# Altium schematic sheet Sheet1.SchDoc
size A3
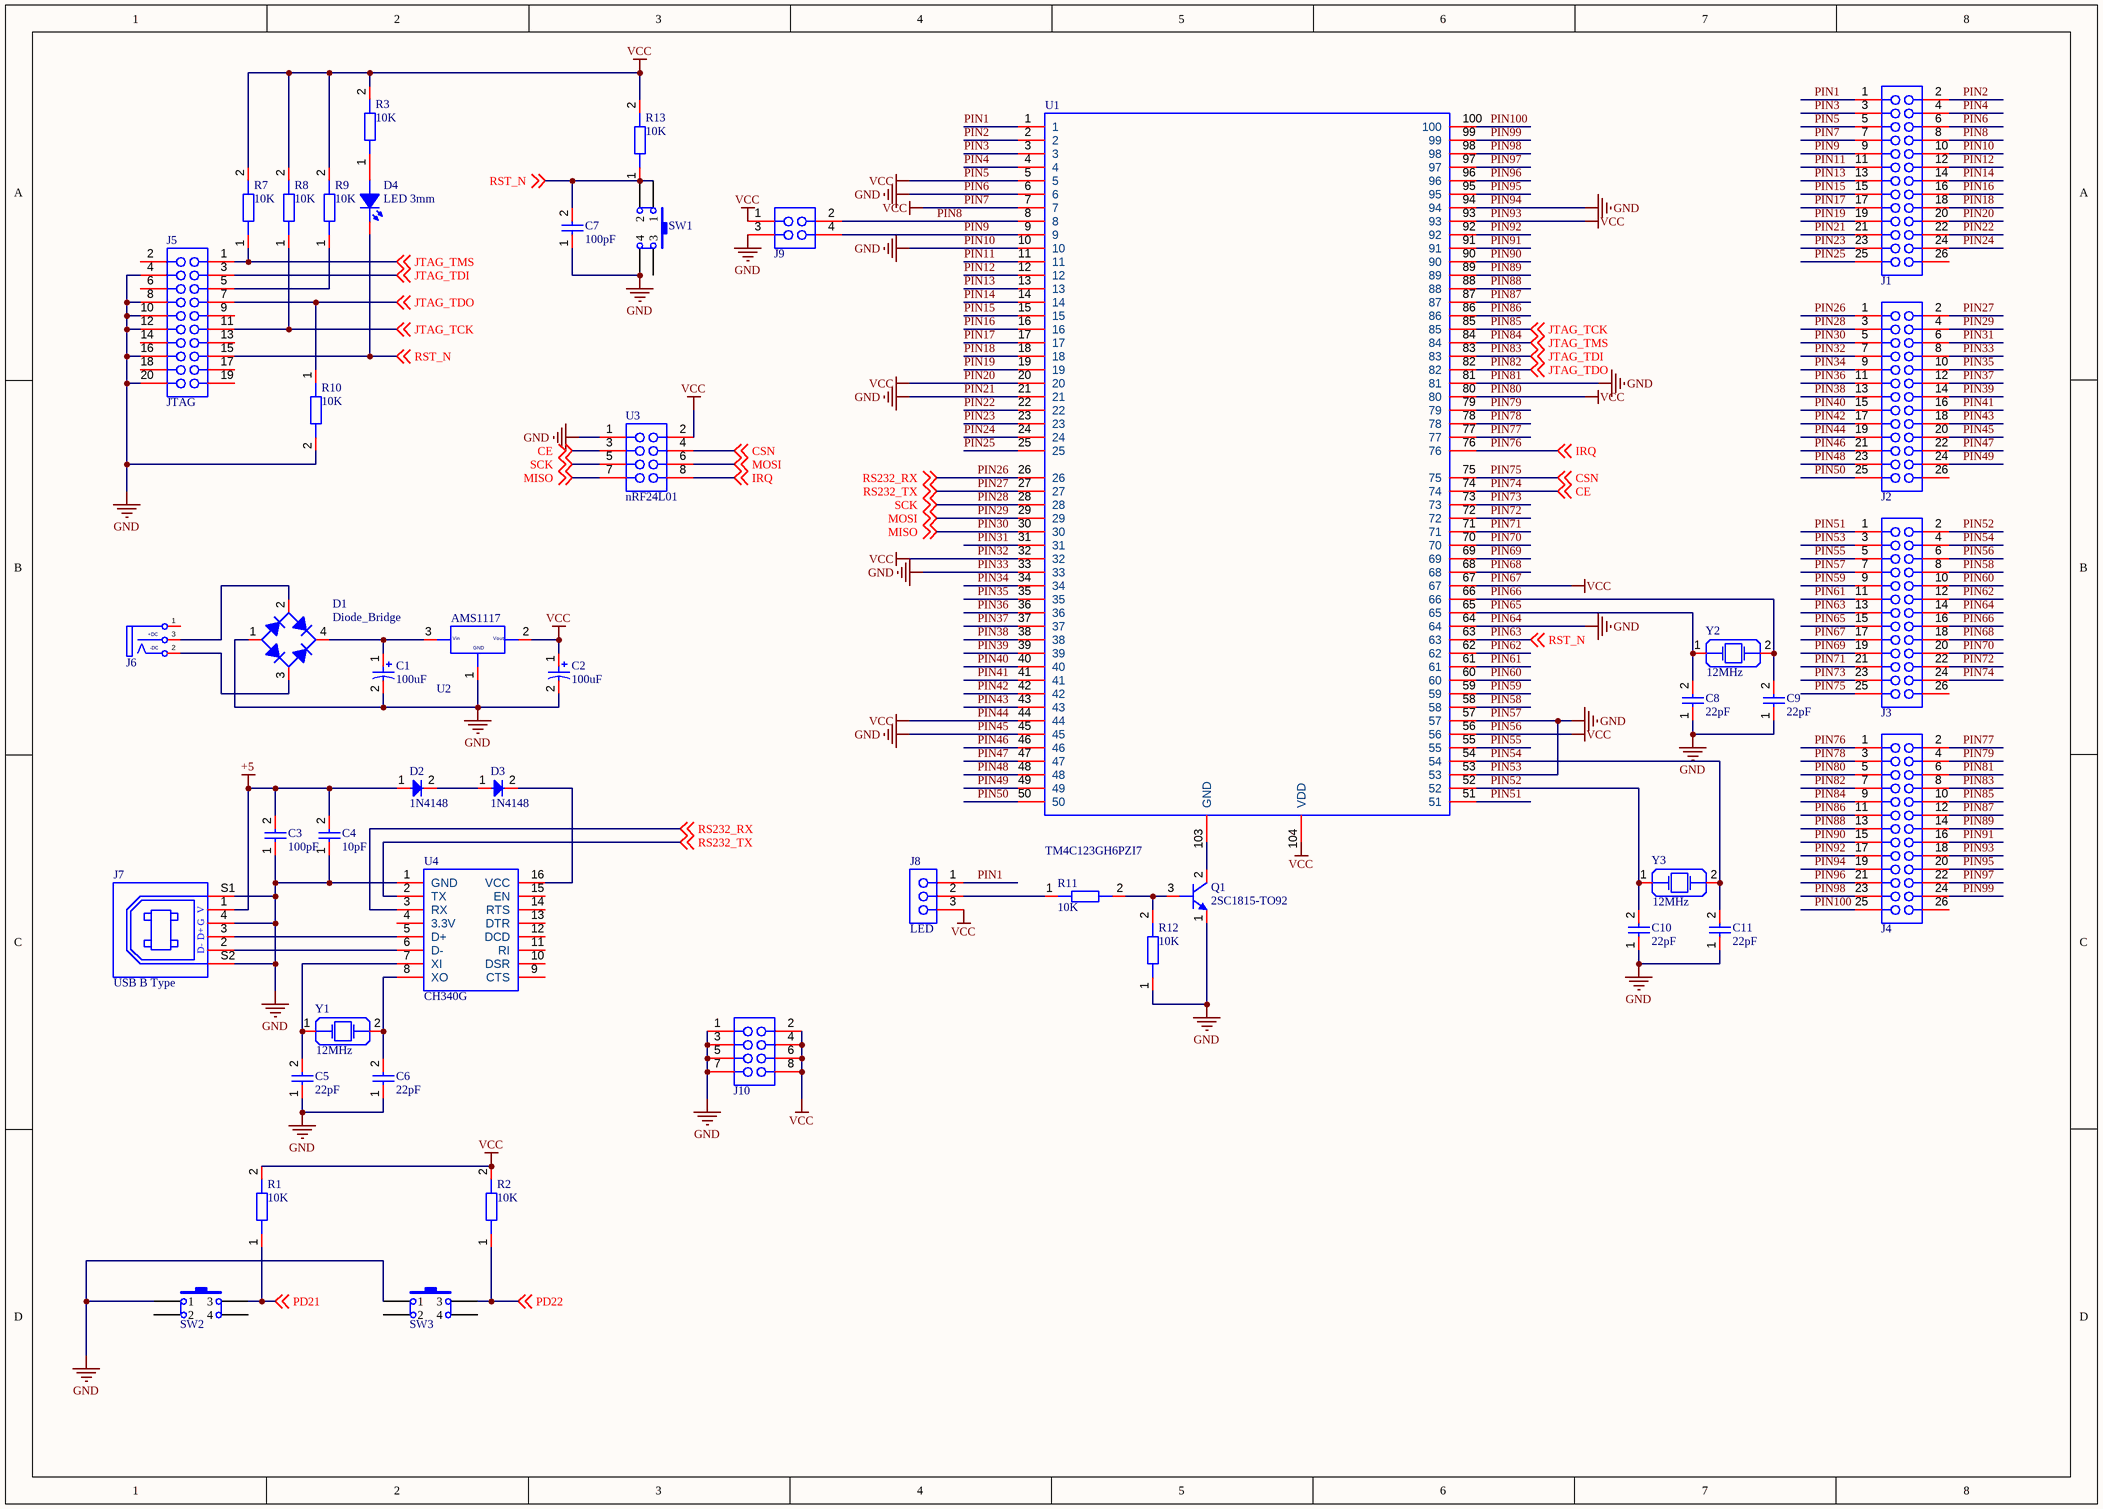
[diagram p0: Sheet1.SchDoc]

## Parts
C1  100uF  [CAP_RAD_D8x11.5_POL_BK]
C2  100uF  [CAP_RAD_D8x11.5_POL_BK]
C3  100pF  [CAP_DISC_PITCH_2.54MM]
C4  10pF  [CAP_DISC_PITCH_2.54MM]
C5  22pF  [CAP_DISC_PITCH_2.54MM]
C6  22pF  [CAP_DISC_PITCH_2.54MM]
C7  100pF  [CAP_DISC_PITCH_2.54MM]
C8  22pF  [CAP_DISC_PITCH_2.54MM]
C9  22pF  [CAP_DISC_PITCH_2.54MM]
C10  22pF  [CAP_DISC_PITCH_2.54MM]
C11  22pF  [CAP_DISC_PITCH_2.54MM]
D1  Diode_Bridge  [DIODE_2A]
D2  1N4148  [DO-35]
D3  1N4148  [DO-35]
D4  LED 3mm  [LED-3MM]
J1  Header 13x2 TH Pitch 2.54mm  [Header 13x2 TH Pitch 2.54mm]  (value not drawn)
J2  Header 13x2 TH Pitch 2.54mm  [Header 13x2 TH Pitch 2.54mm]  (value not drawn)
J3  Header 13x2 TH Pitch 2.54mm  [Header 13x2 TH Pitch 2.54mm]  (value not drawn)
J4  Header 13x2 TH Pitch 2.54mm  [Header 13x2 TH Pitch 2.54mm]  (value not drawn)
J5  JTAG  [IDC_CONNECTOR_20_2.54]
J6  Connector  [JACK-DC]  (value not drawn)
J7  USB B Type  [USB-B-TYPE]
J8  LED  [Header 3x1 TH Pitch 2.54mm]
J9  Header 2x2 TH Pitch 2.54mm  [Header 2x2 TH Pitch 2.54mm]  (value not drawn)
J10  Header 4x2 TH Pitch 2.54mm  [Header 4x2 TH Pitch 2.54mm]  (value not drawn)
Q1  2SC1815-TO92  [TO-92]
R1  10K  [RES-0.25W-H-MF]
R2  10K  [RES-0.25W-H-MF]
R3  10K  [RES-0.25W-H-MF]
R7  10K  [RES-0.25W-H-MF]
R8  10K  [RES-0.25W-H-MF]
R9  10K  [RES-0.25W-H-MF]
R10  10K  [RES-0.25W-H-MF]
R11  10K  [RES-0.25W-H-MF]
R12  10K  [RES-0.25W-H-MF]
R13  10K  [RES-0.25W-H-MF]
SW1  Button1  [BUTTON_HOLE_5.0mm]  (value not drawn)
SW2  Button1  [BUTTON_HOLE_5.0mm]  (value not drawn)
SW3  Button1  [BUTTON_HOLE_5.0mm]  (value not drawn)
U1  TM4C123GH6PZI7  [QFP100-0.5 SOCKET PINOUT]
U2  AMS1117  [SOT223-3]
U3  nRF24L01  [nRF24L01]
U4  CH340G  [SOP16_1.27_3.8]
Y1  12MHz  [HC-49S]
Y2  12MHz  [HC-49S]
Y3  12MHz  [HC-49S]

## Nets
+5: C3.2 C4.2 D2.1 J7.1
PIN10: C1.2 C2.2 C3.1 C4.1 C5.1 C6.1 C7.1 C8.1 C9.1 C10.1 C11.1 D1.1 J1.6 J1.10 J1.21 J2.8 J2.20 J3.3 J3.7 J3.14 J4.6 J4.19 J5.4 J5.8 J5.10 J5.12 J5.16 J5.20 J7.4 J7.S1 J7.S2 J9.3 J10.1 J10.3 J10.5 J10.7 Q1.1(E) R10.2 R12.1 SW1.4 SW2.1 SW3.1 U1.6 U1.10 U1.21 U1.33 U1.45 U1.53 U1.57 U1.64 U1.81 U1.94 U2.1 U3.1 U4.1(GND)  [also labelled GND, PIN21, PIN33, PIN45, PIN53, PIN57, PIN6, PIN64, PIN81, PIN94]
PIN20: C2.1 J1.5 J1.7 J1.20 J2.7 J2.19 J3.6 J3.17 J4.5 J4.18 J8.3 J9.1 J10.2 J10.4 J10.6 J10.8 R1.2 R2.2 R3.2 R7.2 R8.2 R9.2 R13.2 U1.5 U1.7 U1.20 U1.32 U1.44 U1.56 U1.67 U1.80 U1.93 U1.104(VDD) U2.2 U3.2  [also labelled PIN32, PIN44, PIN5, PIN56, PIN67, PIN7, PIN80, PIN93, VCC]
PD21: R1.1 SW2.3 ; off-sheet PD21
PD22: R2.1 SW3.3 ; off-sheet PD22
PIN1: J1.1 J8.1 U1.1
PIN2: J1.2 U1.2
PIN3: J1.3 U1.3
PIN4: J1.4 U1.4
PIN8: J1.8 J9.2 U1.8
PIN9: J1.9 J9.4 U1.9
PIN11: J1.11 U1.11
PIN12: J1.12 U1.12
PIN13: J1.13 U1.13
PIN14: J1.14 U1.14
PIN15: J1.15 U1.15
PIN16: J1.16 U1.16
PIN17: J1.17 U1.17
PIN18: J1.18 U1.18
PIN19: J1.19 U1.19
PIN22: J1.22 U1.22
PIN23: J1.23 U1.23
PIN24: J1.24 U1.24
PIN25: J1.25 U1.25
PIN26: J2.1 U1.26 U4.3(RX) ; off-sheet RS232_RX  [also labelled RS232_RX]
PIN27: J2.2 U1.27 U4.2(TX) ; off-sheet RS232_TX  [also labelled RS232_TX]
PIN28: J2.3 U1.28 U3.5 ; off-sheet SCK  [also labelled SCK]
PIN29: J2.4 U1.29 U3.6 ; off-sheet MOSI  [also labelled MOSI]
PIN30: J2.5 U1.30 U3.7 ; off-sheet MISO  [also labelled MISO]
PIN31: J2.6 U1.31
PIN34: J2.9 U1.34
PIN35: J2.10 U1.35
PIN36: J2.11 U1.36
PIN37: J2.12 U1.37
PIN38: J2.13 U1.38
PIN39: J2.14 U1.39
PIN40: J2.15 U1.40
PIN41: J2.16 U1.41
PIN42: J2.17 U1.42
PIN43: J2.18 U1.43
PIN46: J2.21 U1.46
PIN47: J2.22 U1.47
PIN48: J2.23 U1.48
PIN49: J2.24 U1.49
PIN50: J2.25 U1.50
PIN51: J3.1 U1.51
PIN52: C10.2 J3.2 U1.52 Y3.1
PIN54: C11.2 J3.4 U1.54 Y3.2
PIN55: J3.5 U1.55
PIN58: J3.8 U1.58
PIN59: J3.9 U1.59
PIN60: J3.10 U1.60
PIN61: J3.11 U1.61
PIN62: J3.12 U1.62
PIN63: C7.2 D4.2(K) J3.13 J5.15 R13.1 SW1.1 SW1.2 U1.63 ; off-sheet RST_N  [also labelled RST_N]
PIN65: C8.2 J3.15 U1.65 Y2.1
PIN66: C9.2 J3.16 U1.66 Y2.2
PIN68: J3.18 U1.68
PIN69: J3.19 U1.69
PIN70: J3.20 U1.70
PIN71: J3.21 U1.71
PIN72: J3.22 U1.72
PIN73: J3.23 U1.73
PIN74: J3.24 U1.74 U3.3 ; off-sheet CE  [also labelled CE]
PIN75: J3.25 U1.75 U3.4 ; off-sheet CSN  [also labelled CSN]
PIN76: J4.1 U1.76 U3.8 ; off-sheet IRQ  [also labelled IRQ]
PIN77: J4.2 U1.77
PIN78: J4.3 U1.78
PIN79: J4.4 U1.79
PIN82: J4.7 J5.7 R10.1 U1.82 ; off-sheet JTAG_TDO  [also labelled JTAG_TDO]
PIN83: J4.8 J5.3 U1.83 ; off-sheet JTAG_TDI  [also labelled JTAG_TDI]
PIN84: J4.9 J5.1 R7.1 U1.84 ; off-sheet JTAG_TMS  [also labelled JTAG_TMS]
PIN85: J4.10 J5.11 R8.1 U1.85 ; off-sheet JTAG_TCK  [also labelled JTAG_TCK]
PIN86: J4.11 U1.86
PIN87: J4.12 U1.87
PIN88: J4.13 U1.88
PIN89: J4.14 U1.89
PIN90: J4.15 U1.90
PIN91: J4.16 U1.91
PIN92: J4.17 U1.92
PIN95: J4.20 U1.95
PIN96: J4.21 U1.96
PIN97: J4.22 U1.97
PIN98: J4.23 U1.98
PIN99: J4.24 U1.99
PIN100: J4.25 U1.100
NetC1_1: C1.1 D1.4 U2.3
NetC5_2: C5.2 U4.7(XI) Y1.1
NetC6_2: C6.2 U4.8(XO) Y1.2
NetD1_2: D1.2 J6.3(S)
NetD1_3: D1.3 J6.2(TN)
NetD2_2: D2.2 D3.1
NetD3_2: D3.2 U4.16(VCC)
NetD4_1: D4.1(A) R3.1
NetJ5_5: J5.5 R9.1
NetJ7_2: J7.2 U4.6(D-)
NetJ7_3: J7.3 U4.5(D+)
NetJ8_2: J8.2 R11.1
NetQ1_2: Q1.2(C) U1.103(GND)
NetQ1_3: Q1.3(B) R11.2 R12.2

Not connected (* = marked no-connect by the designer): J1 26; J2 26; J3 26; J4 26; J5 2 6 9 13 14 17 18 19; J6 1(T); SW1 3; SW2 2 4; SW3 2 4; U4 4(3.3V) 9(CTS) 10(DSR) 11(RI) 12(DCD) 13(DTR) 14(RTS) 15(EN)

## Notes on the sheet
- (in symbol AMS1117(SOT-223)) Vin; Vout; GND
- (in symbol JackDC) +DC; -DC
- (in symbol USB B Type) V; G; D+; D-

## Library data of the parts
C1 C2 = Capacitor(Radian)
C3-C11 = Capacitors(Disc)
D2 D3 = Diode 1N4148
J5 = IDC_CONNECTOR_10x2
J6 = JackDC
J8 = Header 3x1 TH Pitch 2.54mm
R1-R3 R7-R13 = Resistors THD
U2 = AMS1117(SOT-223)
Y1-Y3 = Crystal